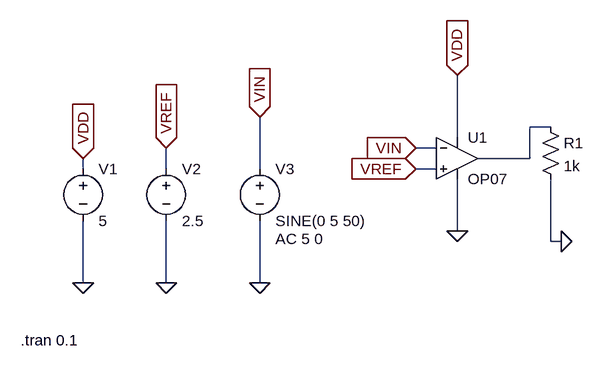
[diagram p0: schematic 1bit_adc.asc]
1bit_adc.asc, the LTspice schematic file:
Version 4.1
SHEET 1 880 680
WIRE 608 -32 576 -32
WIRE 464 -16 464 -112
WIRE 432 0 400 0
WIRE 576 16 576 -32
WIRE 576 16 496 16
WIRE -112 32 -112 16
WIRE 16 32 16 0
WIRE 160 32 160 -48
WIRE 432 32 400 32
WIRE 464 128 464 48
WIRE 608 144 608 48
WIRE 624 144 608 144
WIRE -112 208 -112 112
WIRE 16 208 16 112
WIRE 160 208 160 112
FLAG -112 16 VDD
IOPIN -112 16 In
FLAG 16 0 VREF
IOPIN 16 0 In
FLAG 160 -48 VIN
IOPIN 160 -48 In
FLAG 16 208 0
FLAG 160 208 0
FLAG 464 128 0
FLAG 624 144 0
FLAG -112 208 0
FLAG 464 -112 VDD
IOPIN 464 -112 In
FLAG 400 32 VREF
IOPIN 400 32 In
FLAG 400 0 VIN
IOPIN 400 0 In
SYMBOL voltage -112 16 R0
WINDOW 123 0 0 Left 0
WINDOW 39 0 0 Left 0
SYMATTR InstName V1
SYMATTR Value 5
SYMBOL voltage 16 16 R0
WINDOW 123 0 0 Left 0
WINDOW 39 0 0 Left 0
SYMATTR InstName V2
SYMATTR Value 2.5
SYMBOL voltage 160 16 R0
WINDOW 123 24 124 Left 2
WINDOW 39 0 0 Left 0
SYMATTR InstName V3
SYMATTR Value SINE(0 5 50)
SYMATTR Value2 AC 5 0
SYMBOL OpAmps\\OP07 464 -48 R0
SYMATTR InstName U1
SYMBOL res 592 -48 R0
SYMATTR InstName R1
SYMATTR Value 1k
TEXT -208 296 Left 2 !.tran 0.1

The netlist it stands for:
* 1bit_adc.asc
V1 VDD 0 5
V2 VREF 0 2.5
V3 VIN 0 SINE(0 5 50) AC 5 0
X§U1 VREF VIN VDD 0 N001 LT1001  ; OP07, pins In+ In- V+ V- OUT
R1 N001 0 1k
.tran 0.1
.lib LTC.lib
.backanno
.end